# EAGLE design wiimote_sensor (EAGLE 6.0)
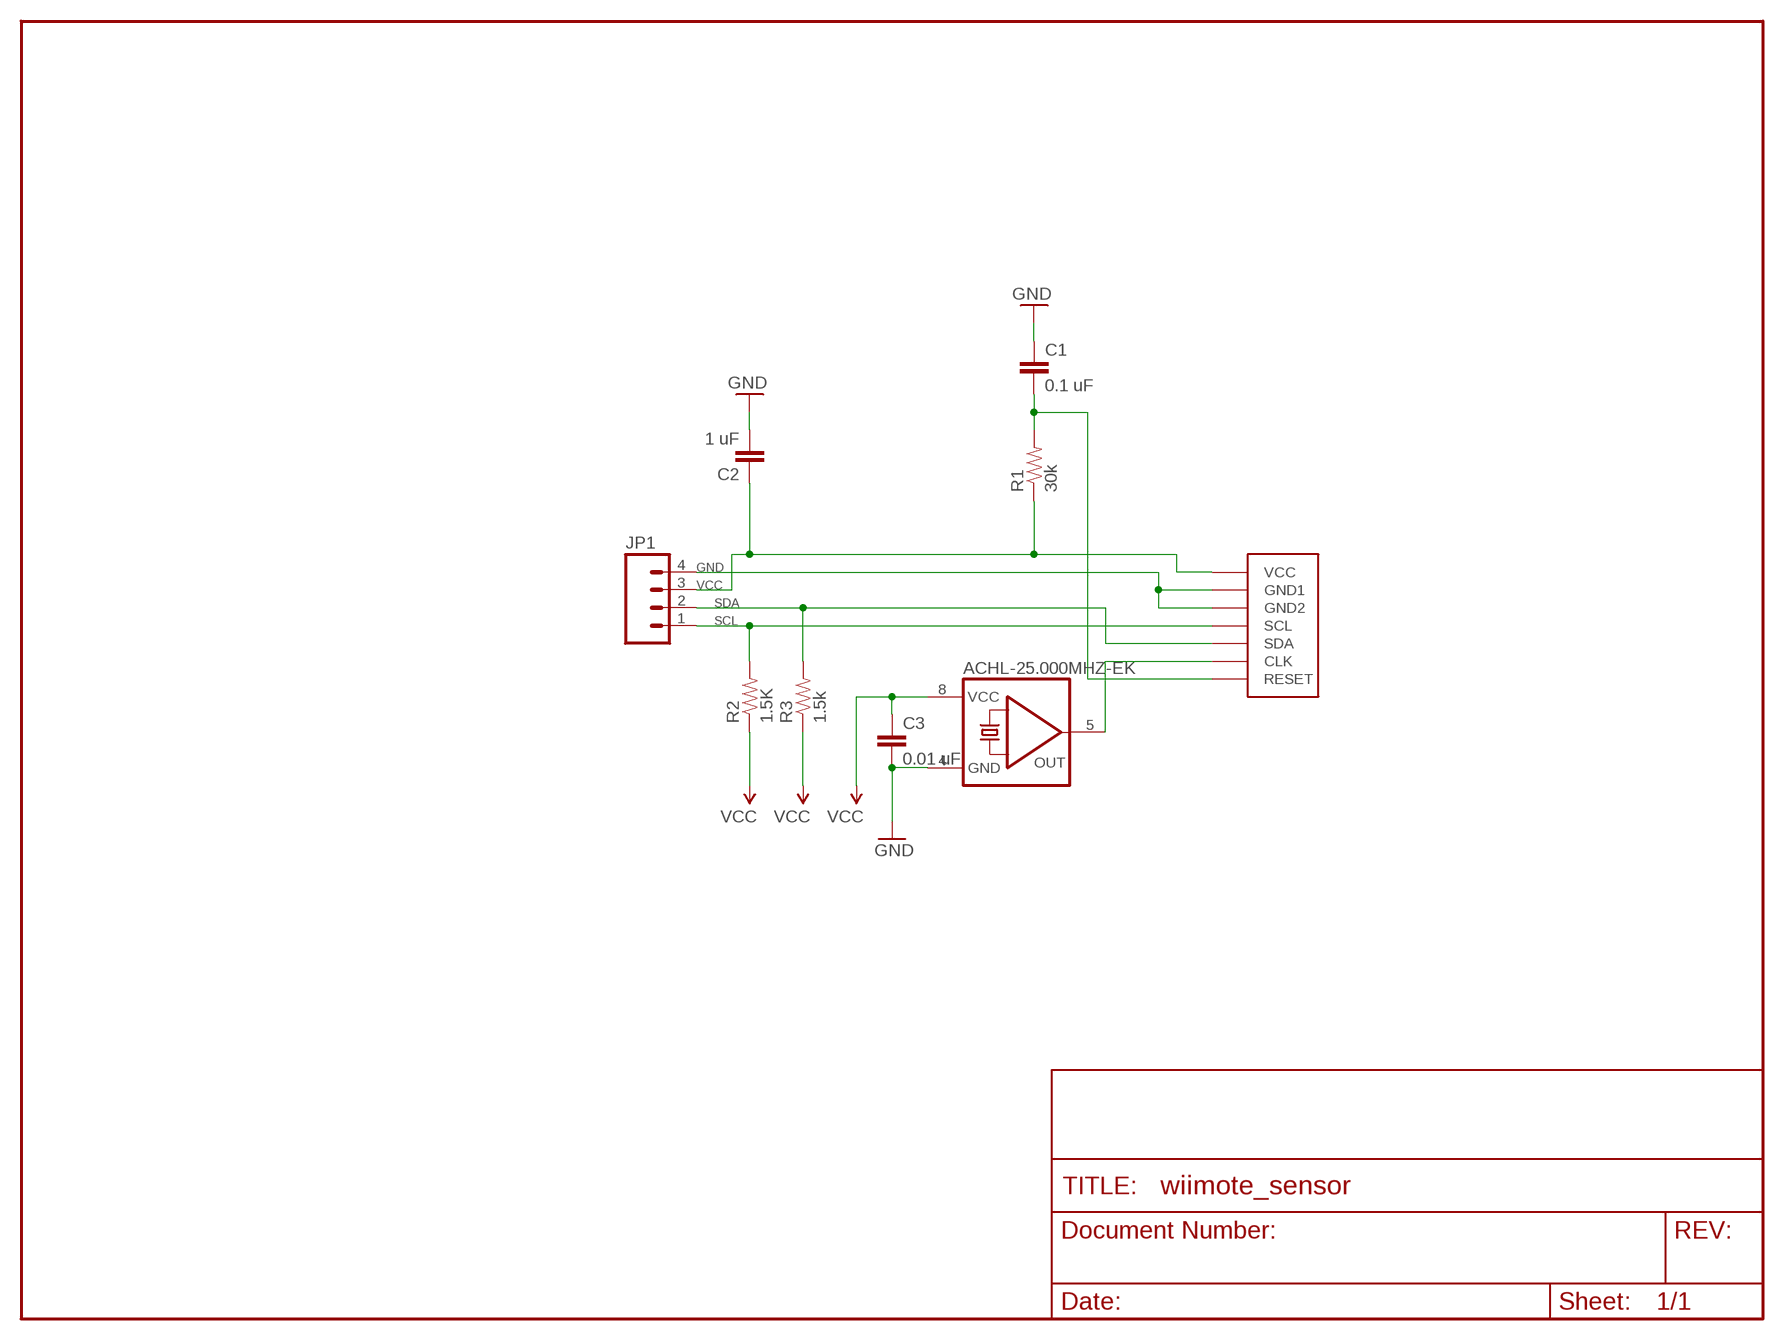
[diagram p0: schematic, sheet 1]

## Parts
ACHL-25.000MHZ-EK  QG5460  [DIL08S]
C1  0.1 uF  CAP0805  [0805]
C2  1 uF  CAP0805  [0805]
C3  0.01 uF  CAP0805  [0805]
JP1  M04POLAR  [MOLEX-1X4]
R1  30k  RESISTOR0805-RES  [0805]
R2  1.5K  RESISTOR0805-RES  [0805]
R3  1.5k  RESISTOR0805-RES  [0805]
U$1  PIXART  [PIXART]

## Nets
CLOCK: ACHL-25.000MHZ-EK.5(OUT) U$1.7(CLK)
GND: ACHL-25.000MHZ-EK.4(GND) C1.1 C2.2 C3.2 JP1.4 U$1.2(GND1) U$1.3(GND2)
RESET: C1.2 R1.2 U$1.8(RESET)
SCL: JP1.1 R2.2 U$1.5(SCL)
SDA: JP1.2 R3.2 U$1.6(SDA)
VCC: ACHL-25.000MHZ-EK.8(VCC) C2.1 C3.1 JP1.3 R1.1 R2.1 R3.1 U$1.1(VCC)

## Library data of the parts
ACHL-25.000MHZ-EK = pie-wiimoteircam:QG5460: CRYSTAL RESONATOR; OC_FARNELL: unknown; OC_NEWARK: unknown
C1-C3 = sparkfun:CAP: Capacitor Standard 0603 ceramic capacitor, and 0.1" leaded capacitor.
JP1 = sparkfun:M04: Header 4 Standard 4-pin 0.1" header. Use with straight break away headers (SKU : PRT-00116), right angle break away headers (PRT-00553), swiss pins (PRT-00743), machine pins (PRT-00117), and female headers (PRT-00115). Molex polarized connector foot print use with SKU : PRT-08231 with associated crimp pins and housings. 1MM SMD Version SKU: PRT-10208
R1-R3 = sparkfun:RESISTOR: Resistor Basic schematic elements and footprints for 0603, 1206, and PTH resistors.
U$1 = pixartcam:PIXART

## Board
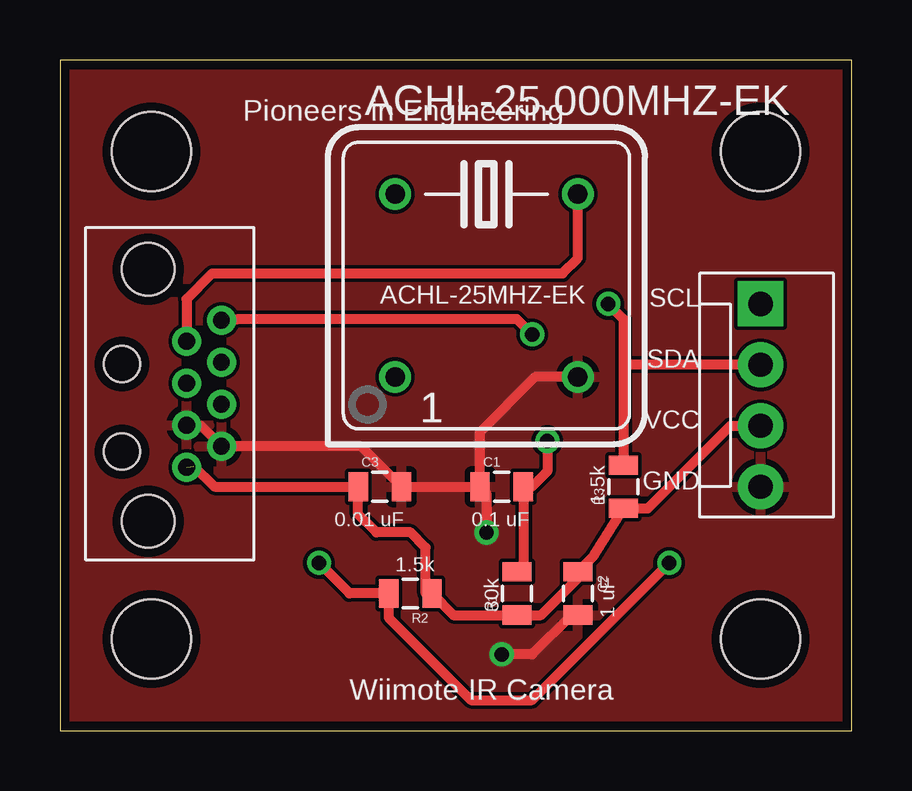
[diagram p1: board, top side]
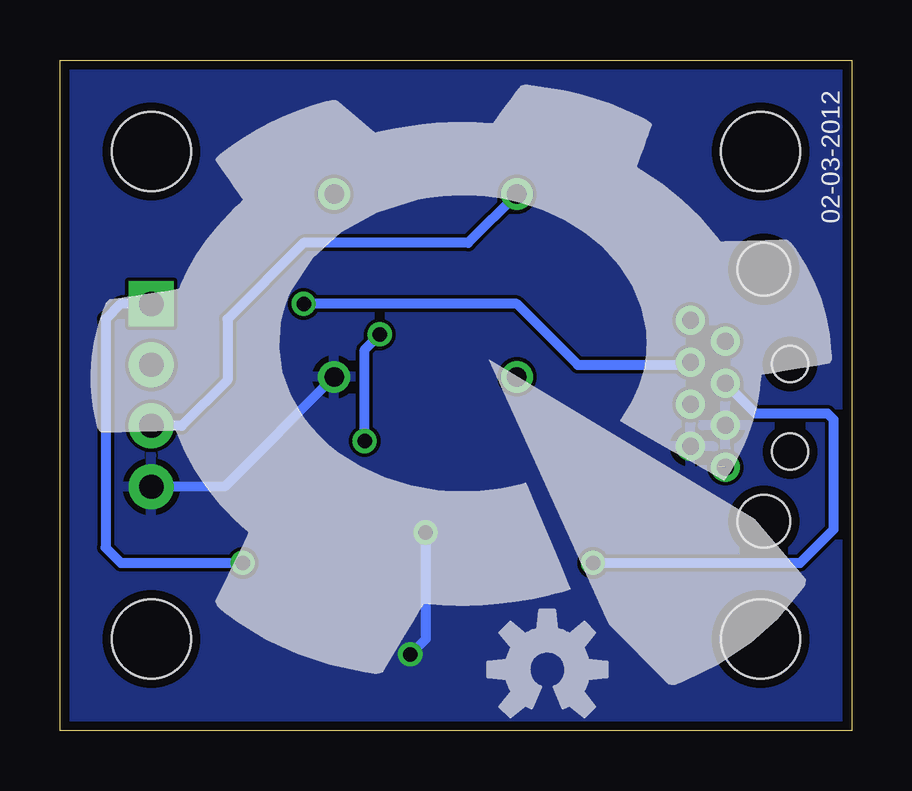
[diagram p2: board, bottom side, seen from below]

Size 33.02 x 27.94 mm. Coordinates in mm from the lower left corner, seen from the top.
Outline: 0,0 33.02,0 33.02,27.94 0,27.94 0,0
Copper layers (1*16): Top 0.0356mm / dielectric 1.5011mm / Bottom 0.0356mm
Design rules: minimum track width 10mil, minimum drill 15mil, track to track 6mil, track to pad 6mil, pad to pad 6mil, via to via 6mil, smd to smd 6mil, copper to edge 15mil, drill to drill 8mil, minimum pad ring 10mil, minimum via ring 8mil, stop-mask expansion 4mil, vias tented up to drill 0mil, thermal gap 10mil

### Footprints (pad centres in the part's own frame; a part is rotated, then mirrored left to right if it is on the bottom)
DIL08S = drill 0.813: 1 -3.81,-3.81; 4 3.81,-3.81; 5 3.81,3.81; 8 -3.81,3.81
0805 = smd 0.8 x 1.2: 1 -0.9,0; 2 0.9,0
MOLEX-1X4 = drill 1.016 pad 1.88 square: 1 0,0 | drill 1.016 pad 1.88: 2 2.54,0; 3 5.08,0; 4 7.62,0
PIXART = drill 0.7: 1 -3,-0.2; 2 -2.125,-1.65; 3 -1.25,-0.2; 4 -0.375,-1.65; 5 0.5,-0.2; 6 1.375,-1.65; 7 2.25,-0.2; 8 3.125,-1.65 | hole 2.2: -5.25,1.4; 5.25,1.4 | hole 1.5: 1.3,2.5; -2.35,2.5
STAND-OFF = hole 3.302: 0,0

### Placement (x,y rotation side)
ACHL-25.000MHZ-EK  17.78,18.54 0 top
C1  18.41,10.16 0 top
C2  21.59,5.71 270 top
C3  13.34,10.16 0 top
JP1  29.21,17.78 270 top
R1  19.05,5.71 90 top
R2  14.61,5.71 180 top
R3  23.5,10.16 90 top
U$1  5.08,13.97 90 top
U$2  [PIE-LOGO]  15.24,15.24 0 bottom
U$3  [OSHW-LOGO-M]  12.7,2.54 0 bottom
U$4  [STAND-OFF]  3.81,24.13 0 top
U$5  [STAND-OFF]  29.21,24.13 0 top
U$6  [STAND-OFF]  29.21,3.81 0 top
U$7  [STAND-OFF]  3.81,3.81 0 top

### Tracks (layer width: path | path; a pad name or v marks a point on that pad's centre or on a via)
CLOCK
  Top 0.406: ACHL-25.000MHZ-EK.5 21.59,19.68 20.95,19.05 6.35,19.05 5.28,17.98 U$1.7
GND  (via drill 0.6)
  Top 0.406: C2.2 21.32,4.82 19.68,3.17 v18.41,3.17 | C1.1 C3.2 12.55,11.85 U$1.2 5.86,12.72 U$1.3 | C1.1 17.52,12.44 19.81,14.73 ACHL-25.000MHZ-EK.4 | C1.1 17.78,9.89 v17.78,8.26
  Bottom 0.406: ACHL-25.000MHZ-EK.4 26.16,10.16 JP1.4 | v17.78,8.26 17.78,3.81 v18.41,3.17
  pour Top: 0,27.94 33.02,27.94 33.02,0 0,0
  pour Bottom: 0,27.94 0,0 33.02,0 33.02,27.94
RESET  (via drill 0.6)
  Top 0.406: R1.2 19.32,6.88 C1.2 19.68,10.16 20.32,10.79 v20.32,12.06 | v19.68,16.51 19.05,17.14 7.62,17.14 7.42,17.14 6.78,17.14 U$1.8
  Bottom 0.406: v20.32,12.06 20.32,15.88 v19.68,16.51
SCL  (via drill 0.6)
  Top 0.406: 24.77,6.35 v25.4,6.99 19.68,1.27 17.14,1.27 13.71,4.71 R2.2 12.06,5.71 v10.79,6.99
  Bottom 0.406: JP1.1 30.48,17.78 31.11,17.14 31.11,7.62 30.48,6.99 v25.4,6.99 | v10.79,6.99 2.16,6.99 0.76,8.38 0.76,12.95 1.02,13.21 4.02,13.21 U$1.5
SDA  (via drill 0.6)
  Top 0.406: v22.86,17.78 23.5,17.14 23.5,15.24 | 23.5,15.24 R3.2 | JP1.2 23.5,15.24
  Bottom 0.406: v22.86,17.78 13.97,17.78 11.43,15.24 6.83,15.24 U$1.6
VCC  (1 unrouted)
  Top 0.254: 21.59,6.35 C2.1
  Top 0.406: 21.59,6.35 20.05,4.82 R1.1 16.41,4.82 R2.1 15.24,5.71 15.24,7.62 14.61,8.26 13.2,8.26 12.44,9.02 C3.1 6.44,10.16 5.58,11.02 | C2.1 22.23,7.25 R3.1 24.5,9.26 27.94,12.7 JP1.3
  Bottom 0.406: ACHL-25.000MHZ-EK.8 16,20.32 22.86,20.32 26.04,17.14 26.04,14.61 27.94,12.7 JP1.3

### Text on the board
tPlace: Pioneers in Engineering | ACHL-25MHZ-EK | SCL | SDA | VCC | 1.5k | GND | 0.01 uF | 0.1 uF | 1.5k | 30k | 1 uF | Wiimote IR Camera
bPlace: 02-03-2012